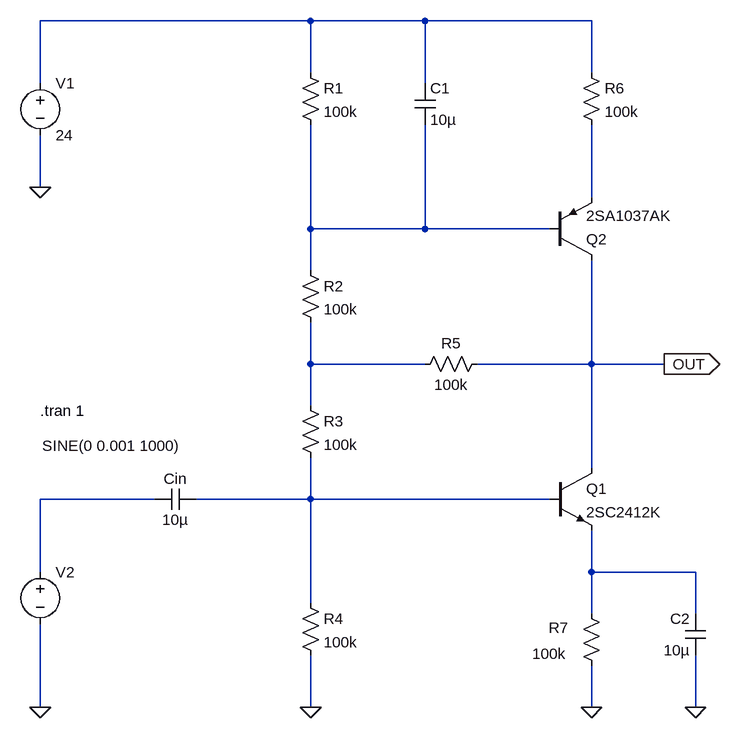
[diagram p0: schematic analog_amp.asc]
analog_amp.asc, the LTspice schematic file:
Version 4
SHEET 1 880 728
WIRE 208 -416 -208 -416
WIRE 384 -416 208 -416
WIRE 640 -416 384 -416
WIRE 208 -336 208 -416
WIRE 640 -336 640 -416
WIRE -208 -320 -208 -416
WIRE 384 -320 384 -416
WIRE -208 -160 -208 -240
WIRE 640 -144 640 -256
WIRE 208 -96 208 -256
WIRE 384 -96 384 -256
WIRE 384 -96 208 -96
WIRE 576 -96 384 -96
WIRE 208 -32 208 -96
WIRE 208 112 208 48
WIRE 384 112 208 112
WIRE 640 112 640 -48
WIRE 640 112 464 112
WIRE 752 112 640 112
WIRE 208 176 208 112
WIRE 640 272 640 112
WIRE -32 320 -208 320
WIRE 208 320 208 256
WIRE 208 320 32 320
WIRE 576 320 208 320
WIRE -208 432 -208 320
WIRE 640 432 640 368
WIRE 800 432 640 432
WIRE 208 480 208 320
WIRE 640 496 640 432
WIRE 800 496 800 432
WIRE -208 640 -208 512
WIRE 208 640 208 560
WIRE 640 640 640 576
WIRE 800 640 800 560
FLAG 640 640 0
FLAG -208 640 0
FLAG -208 -160 0
FLAG 208 640 0
FLAG 800 640 0
FLAG 752 112 OUT
IOPIN 752 112 Out
SYMBOL npn 576 272 R0
SYMATTR InstName Q1
SYMATTR Value 2SC2412K
SYMBOL pnp 576 -48 M180
SYMATTR InstName Q2
SYMATTR Value 2SA1037AK
SYMBOL res 624 -352 R0
SYMATTR InstName R6
SYMATTR Value 100k
SYMBOL res 624 480 R0
WINDOW 0 -50 38 Left 2
WINDOW 3 -75 78 Left 2
SYMATTR InstName R7
SYMATTR Value 100k
SYMBOL voltage -208 -336 R0
WINDOW 123 0 0 Left 0
WINDOW 39 0 0 Left 0
SYMATTR InstName V1
SYMATTR Value 24
SYMBOL voltage -208 416 R0
WINDOW 123 0 0 Left 0
WINDOW 39 0 0 Left 0
WINDOW 3 3 -178 Left 2
SYMATTR InstName V2
SYMATTR Value SINE(0 0.001 1000)
SYMBOL cap 32 304 R90
WINDOW 0 0 32 VBottom 2
WINDOW 3 32 32 VTop 2
SYMATTR InstName Cin
SYMATTR Value 10µ
SYMBOL cap 816 560 R180
WINDOW 0 24 56 Left 2
WINDOW 3 24 8 Left 2
SYMATTR InstName C2
SYMATTR Value 10µ
SYMBOL res 192 -352 R0
SYMATTR InstName R1
SYMATTR Value 100k
SYMBOL res 192 -48 R0
SYMATTR InstName R2
SYMATTR Value 100k
SYMBOL res 192 464 R0
SYMATTR InstName R4
SYMATTR Value 100k
SYMBOL res 480 96 R90
WINDOW 0 0 56 VBottom 2
WINDOW 3 32 56 VTop 2
SYMATTR InstName R5
SYMATTR Value 100k
SYMBOL res 192 160 R0
SYMATTR InstName R3
SYMATTR Value 100k
SYMBOL cap 368 -320 R0
SYMATTR InstName C1
SYMATTR Value 10µ
TEXT -208 184 Left 2 !.tran 1

The netlist it stands for:
* analog_amp.asc
Q1 OUT N006 N007 0 2SC2412K
Q2 OUT N003 N002 0 2SA1037AK
R6 N001 N002 100k
R7 N007 0 100k
V1 N001 0 24
V2 N005 0 SINE(0 0.001 1000)
Cin N006 N005 10µ
C2 0 N007 10µ
R1 N001 N003 100k
R2 N003 N004 100k
R4 N006 0 100k
R5 OUT N004 100k
R3 N004 N006 100k
C1 N001 N003 10µ
.model NPN NPN
.model PNP PNP
.lib standard.bjt
.tran 1
.backanno
.end